# Altium schematic sheet Power.SchDoc
size A3; SheetNumber: 3; SheetTotal: 6
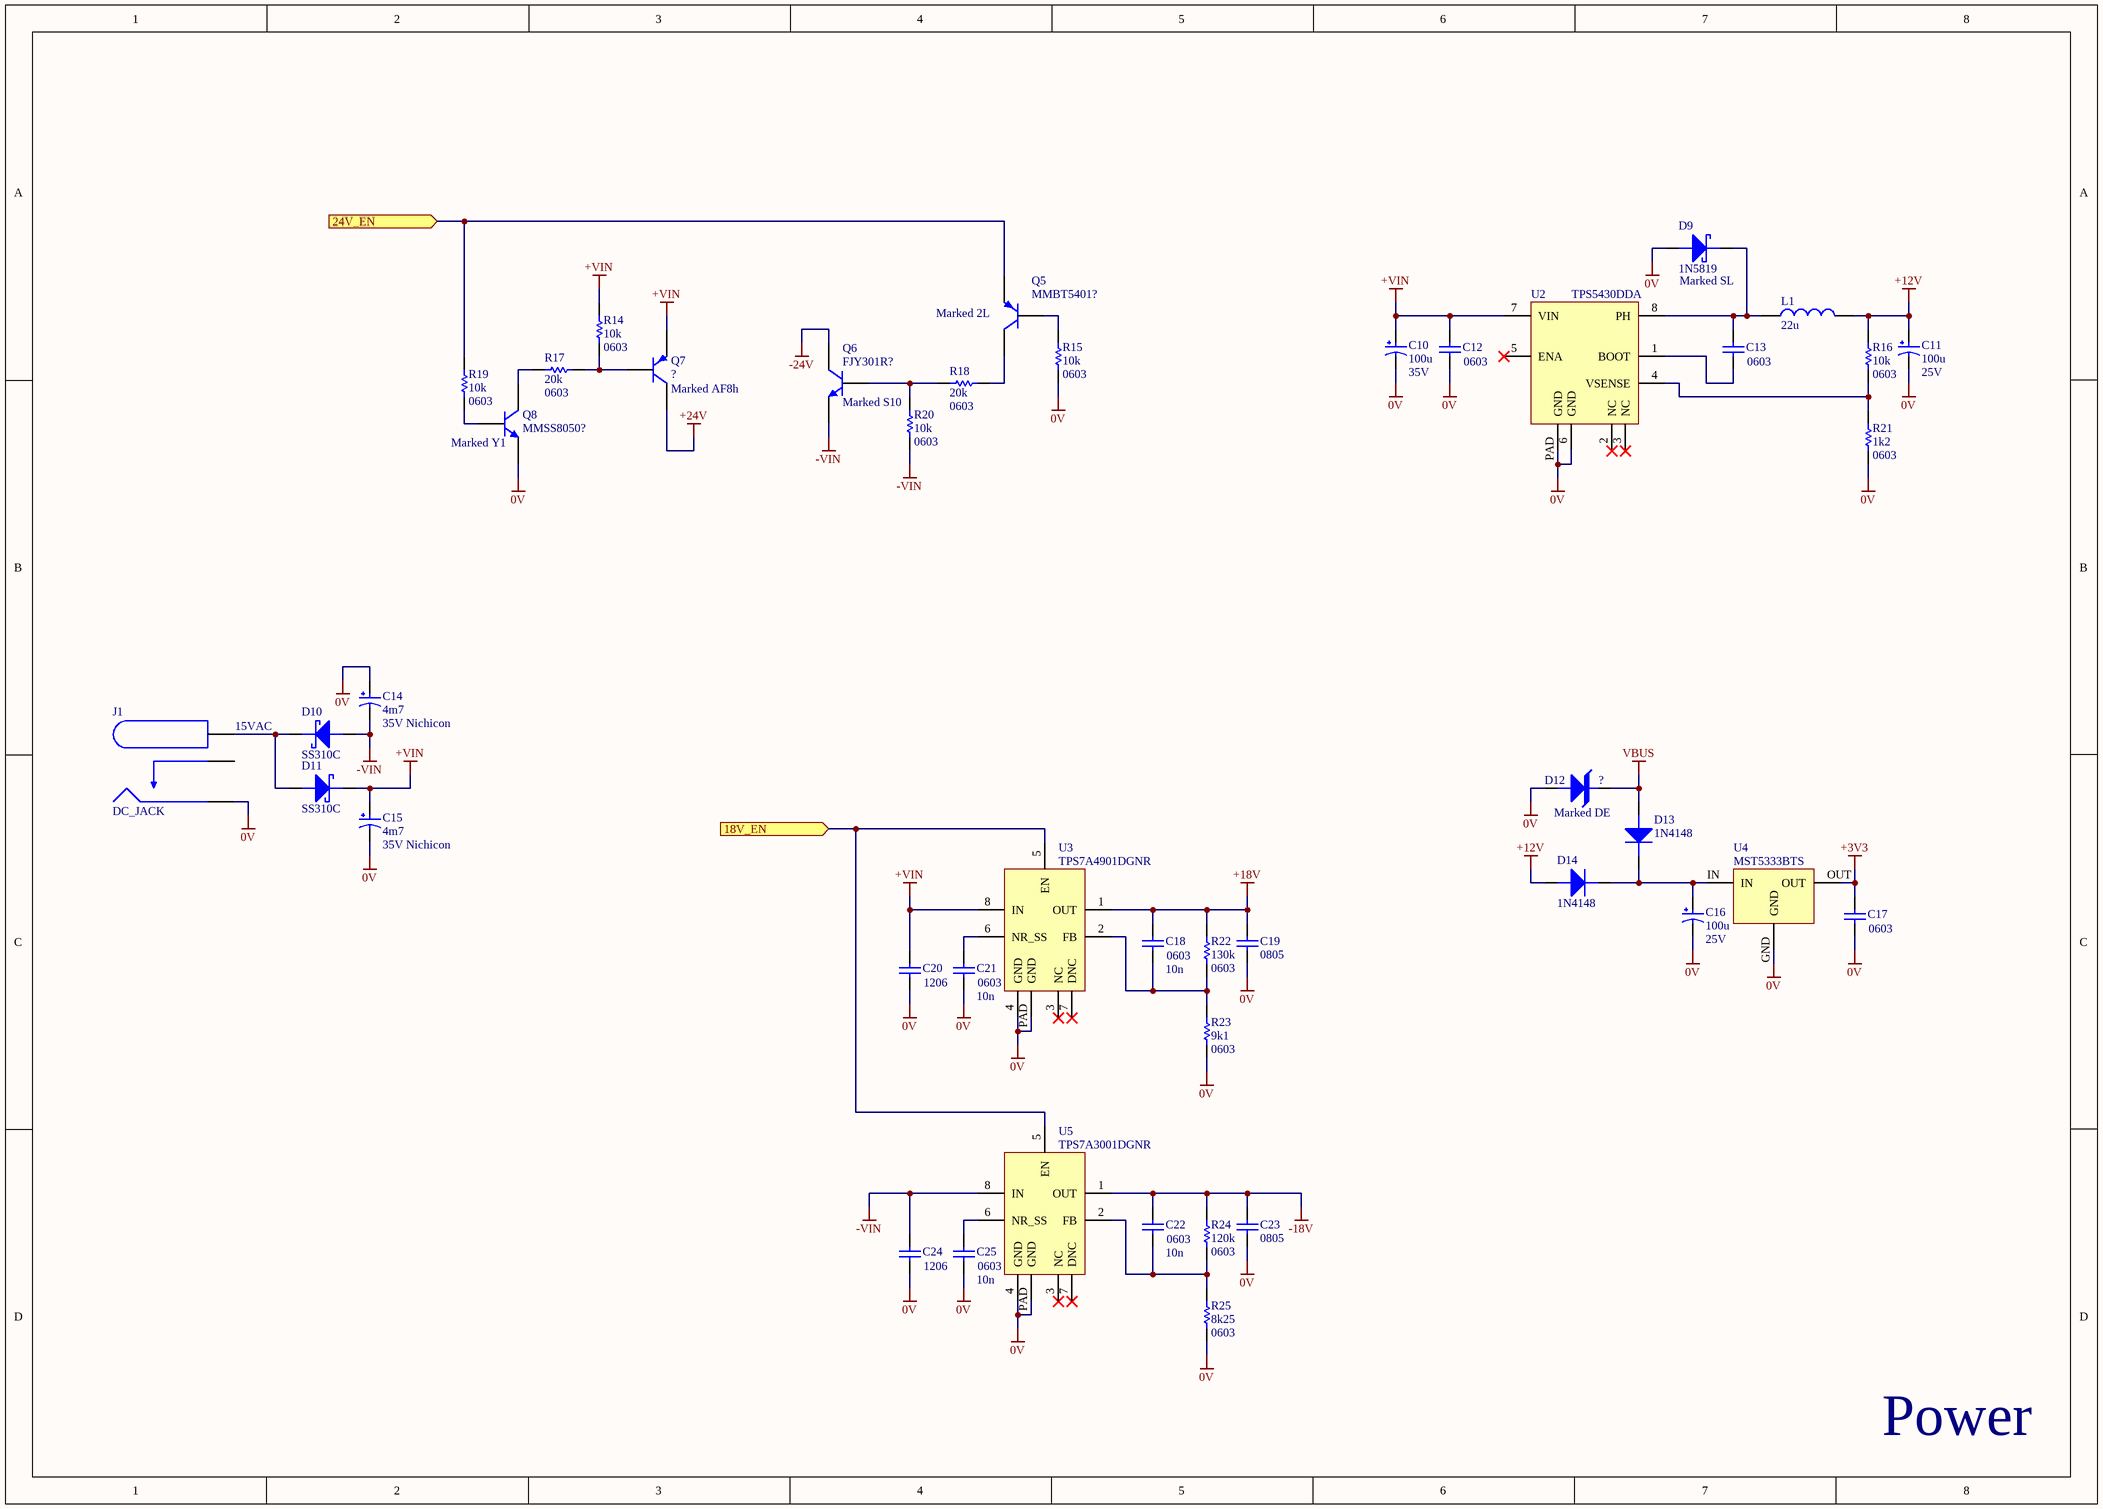
[diagram p0: Power.SchDoc]

## Parts
C10  value 100u  Notes: 35V  [CAPAE13X20]  (hidden comment: 860160378038)
C11  value 100u  Notes: 25V  [CAPAE13X20]  (hidden comment: 860160378038)
C12  Package: 0603  [CAPC1608X09N]  (hidden comment: C_MLCC_0603)
C13  Package: 0603  [CAPC1608X09N]  (hidden comment: C_MLCC_0603)
C14  value 4m7  Notes: 35V Nichicon  [CAPAE13X20]  (hidden comment: 860160378038)
C15  value 4m7  Notes: 35V Nichicon  [CAPAE13X20]  (hidden comment: 860160378038)
C16  value 100u  Notes: 25V  [CAPAE13X20]  (hidden comment: 860160378038)
C17  Package: 0603  [CAPC1608X09N]  (hidden comment: C_MLCC_0603)
C18  value 10n  Package: 0603  [CAPC1608X09N]  (hidden comment: C_MLCC_0603)
C19  Package: 0805  [CAPC2012X14N]  (hidden comment: C_MLCC_0805)
C20  Package: 1206  [C_NP_1206]  (hidden comment: C_MLCC_1206)
C21  value 10n  Package: 0603  [CAPC1608X09N]  (hidden comment: C_MLCC_0603)
C22  value 10n  Package: 0603  [CAPC1608X09N]  (hidden comment: C_MLCC_0603)
C23  Package: 0805  [CAPC2012X14N]  (hidden comment: C_MLCC_0805)
C24  Package: 1206  [C_NP_1206]  (hidden comment: C_MLCC_1206)
C25  value 10n  Package: 0603  [CAPC1608X09N]  (hidden comment: C_MLCC_0603)
D9  1N5819
D10  SS310C  [DIOM6959X26N]
D11  SS310C  [DIOM6959X26N]
D12  TVS  [DIOM4336X24N]  (value not drawn)
D13  1N4148
D14  1N4148
J1  DC_JACK  [DC_JACK]
L1  value 22u  (hidden comment: L)
Q5  value MMBT5401?  [SOT95P230X110-3N]  (hidden comment: MMBT5401)
Q6  value FJY301R?  [SOT95P230X110-3N]  (hidden comment: MMBT5551)
Q7  MMBT5401  [SOT95P230X110-3N]  (value not drawn)
Q8  value MMSS8050?  [SOT95P230X110-3N]  (hidden comment: MMBT5551)
R14  value 10k  Package: 0603  [RESC1608X06N]  (hidden comment: R)
R15  value 10k  Package: 0603  [RESC1608X06N]  (hidden comment: R)
R16  value 10k  Package: 0603  [RESC1608X06N]  (hidden comment: R)
R17  value 20k  Package: 0603  [RESC1608X06N]  (hidden comment: R)
R18  value 20k  Package: 0603  [RESC1608X06N]  (hidden comment: R)
R19  value 10k  Package: 0603  [RESC1608X06N]  (hidden comment: R)
R20  value 10k  Package: 0603  [RESC1608X06N]  (hidden comment: R)
R21  value 1k2  Package: 0603  [RESC1608X06N]  (hidden comment: R)
R22  value 130k  Package: 0603  [RESC1608X06N]  (hidden comment: R)
R23  value 9k1  Package: 0603  [RESC1608X06N]  (hidden comment: R)
R24  value 120k  Package: 0603  [RESC1608X06N]  (hidden comment: R)
R25  value 8k25  Package: 0603  [RESC1608X06N]  (hidden comment: R)
U2  TPS5430DDA  [SOIC127P600X170_HS-9N]
U3  TPS7A4901DGNR  [TSOP65P490X110_HS-9N]
U4  MST5333BTS  [SOT89-150P410X160-3N]
U5  TPS7A3001DGNR  [TSOP65P490X110_HS-9N]

## Ports
18V_EN (in, see Top[3B], STM[3B]), 24V_EN (in, see Top[3B], STM[5B])

## Nets
0V: C10.- C11.- C12.1 C14.+ C15.- C16.- C17.1 C19.1 C20.1 C21.1 C23.1 C24.1 C25.1 D9.A D12.A J1.S Q8.E R15.1 R21.1 R23.1 R25.1 U2.6(GND) U2.PAD(GND) U3.4(GND) U3.PAD(GND) U4.GND U5.4(GND) U5.PAD(GND)
+3V3: C17.2 U4.OUT
+12V: C11.+ D14.A L1.2 R16.2
+18V: C18.2 C19.2 R22.2 U3.1(OUT)
+24V: Q7.C
+VIN: C10.+ C12.2 C15.+ C20.2 D11.K Q7.E R14.1 U2.7(VIN) U3.8(IN)
-18V: C22.2 C23.2 R24.2 U5.1(OUT)
-24V: Q6.C
-VIN: C14.- C24.2 D10.A Q6.E R20.2 U5.8(IN)
VBUS: D12.K D13.A
18V_EN: U3.5(EN) U5.5(EN) ; port 18V_EN
24V_EN: Q5.E R19.1 ; port 24V_EN
NetC13_1: C13.1 U2.1(BOOT)
NetC13_2: C13.2 D9.K L1.1 U2.8(PH)
NetC16_+: C16.+ D13.K D14.K U4.IN
NetC18_1: C18.1 R22.1 R23.2 U3.2(FB)
NetC21_2: C21.2 U3.6(NR_SS)
NetC22_1: C22.1 R24.1 R25.2 U5.2(FB)
NetC25_2: C25.2 U5.6(NR_SS)
NetD10_K: D10.K D11.A J1.T
NetQ5_B: Q5.B R15.2
NetQ5_C: Q5.C R18.1
NetQ6_B: Q6.B R18.2 R20.1
NetQ7_B: Q7.B R14.2 R17.1
NetQ8_B: Q8.B R19.2
NetQ8_C: Q8.C R17.2
NetR16_1: R16.1 R21.2 U2.4(VSENSE)

Not connected (* = marked no-connect by the designer): J1 SN; U2 2(NC)* 3(NC)* 5(ENA)*; U3 3(NC)* 7(DNC)*; U5 3(NC)* 7(DNC)*

## Notes on the sheet
- (near Q5) Marked 2L
- (near D9) Marked SL
- (near Q8) Marked Y1
- (near Q7) Marked AF8h
- (near Q6) Marked S10
- 15VAC
- Marked DE
- Power

## Library data of the parts
C10 C11 C14-C16 = 860160378038: Alum. Electrolytic Cap 2200µF 16V 13mm Radial WCAP-ATLL; Lifetime 7000h +105°C; Manufacturer: Würth Elektronik; Impedance: 90mR; Ripple Current: 2.082A; Polarity: Polar; Life (Hours): 7000Hour; Tolerance: 20%; Capacitance: 2.2mF; Height - Seated (Max): 0.846inch; RoHS Compliant: Yes; Max Operating Temperature: 105°C; Sub-Category: Electrolytic; Mount: Through Hole; Min Operating Temperature: -55°C; Packaging: Tape and Reel; Category: Capacitor; Package Quantity: 300; Voltage Rating: 16V; Lead Pitch: 0.197inch; Case/Package: Radial; Manufacturer Part Number: 860160378038; Component Type: Standard_Passive_C
C12 C13 C17 C18 C21 C22 C25 = C_MLCC_0603: Generic MLCC 0603 Non Polarized Capacitor; Category: Capacitor; Sub-Category: MLCC; Manufacturer: Generic; Notes: *
  C12 C13 C17: Value: *
C19 C23 = C_MLCC_0805: Generic MLCC 0805 Non Polarized Capacitor; Category: Capacitor; Sub-Category: MLCC; Manufacturer: Generic; Notes: *; Value: *
C20 C24 = C_MLCC_1206: Generic MLCC Non Polarized Capacitor 1206; Manufacturer: Generic; Category: Capacitor; Sub-Category: MLCC; Notes: *; Value: *
D9 = 1N5819: Generic Schottky, 1N5819; Manufacturer Part Number: SS3H10-E3/9AT; Diode Element Material: SILICON; Forward Voltage-Max (VF): 650mV; Time @ Peak Reflow Temperature-Max (s): 40s; Diode Type: RECTIFIER; Number of Phases: 1; Non-rep Pk Forward Current-Max: 100A; Rep Pk Reverse Voltage-Max: 100V; Application(s): EFFICIENCY; Qualification Status: Not Qualified; JEDEC-95 Code: DO-214AB; Max Output Current: 3A; Package Body Material: Plastic; Terminal Position: DUAL; JESD-609 Code: e3; JESD-30 Code: R-PDSO-C2; Technology: SCHOTTKY; Min Operating Temperature: -65°C; Terminal Finish: Tin; Package Shape: Rectangular; RoHS Compliant: Yes; Manufacturer: Generic; REACH SVHC: No SVHC; Moisture Sensitivity Level: 1; Number of Elements: 1; Category: Diode; Peak Reflow Temperature (Cel): 260°C; Terminal Form: C BEND; Max Operating Temperature: 175°C; Number of Pins: 2; Package Style: SMALL OUTLINEMeter; Sub-Category: Power; Surface Mount: Yes; Component Type: Standard_Diode; Value: 1N5819
D10 D11 = SS310C: Rectifier Diode, Schottky, 1 Phase, 1 Element, 3A, 100V V(RRM), Silicon, DO-214AB; Manufacturer: Generic; Manufacturer Part Number: SS3H10-E3/9AT; Forward Voltage-Max (VF): 650mV; Time @ Peak Reflow Temperature-Max (s): 40s; Number of Phases: 1; Non-rep Pk Forward Current-Max: 100A; Application(s): EFFICIENCY; Qualification Status: Not Qualified; Package Body Material: Plastic; Terminal Position: DUAL; Diode Element Material: SILICON; JESD-609 Code: e3; JESD-30 Code: R-PDSO-C2; Technology: SCHOTTKY; Diode Type: RECTIFIER; Min Operating Temperature: -65°C; Terminal Finish: Tin; Package Shape: Rectangular; RoHS Compliant: Yes; Rep Pk Reverse Voltage-Max: 100V; REACH SVHC: No SVHC; Moisture Sensitivity Level: 1; Number of Elements: 1; Category: Diode; Peak Reflow Temperature (Cel): 260°C; Terminal Form: C BEND; JEDEC-95 Code: DO-214AB; Max Operating Temperature: 175°C; Max Output Current: 3A; Number of Pins: 2; Package Style: SMALL OUTLINEMeter; Sub-Category: Power; Surface Mount: Yes; Component Type: Standard_Diode; Package: SMC; Value: SS310C
D12 = TVS: Generic TVS diode; Manufacturer: Bourns; Manufacturer Part Number: SMBJ30A; Breakdown Voltage-Nom: 35.8V; JEDEC-95 Code: DO-214AA; Diode Element Material: SILICON; Min Breakdown Voltage: 33.3V; Max Power Dissipation: 5W; Rep Pk Reverse Voltage-Max: 30V; Number of Elements: 1; Reference Standard: IEC-61000-4-2; Diode Type: TRANS VOLTAGE SUPPRESSOR; Max Breakdown Voltage: 36.8V; Non-rep Peak Rev Power Dis-Max: 600W; Package Body Material: Plastic; Polarity: Unidirectional; Qualification Status: Not Qualified; Min Operating Temperature: -55°C; REACH SVHC: No SVHC; Terminal Finish: Tin; Moisture Sensitivity Level: 1; Number of Pins: 2; JESD-30 Code: R-PDSO-C2; Technology: AVALANCHE; Terminal Position: DUAL; Max Operating Temperature: 150°C; Package Style: SMALL OUTLINEMeter; Package Shape: Rectangular; Terminal Form: C BEND; RoHS Compliant: Yes; Surface Mount: Yes; JESD-609 Code: e3; Sub-Category: TVS; Category: Diode; Component Type: Standard_Diode; Value: ?
D13 D14 = 1N4148: Generic small signal diode; Manufacturer Part Number: BAT48ZFILM; Number of Elements: 1; Rep Pk Reverse Voltage-Max: 40V; Package Body Material: Plastic; Diode Type: RECTIFIER; Forward Voltage-Max (VF): 250mV; Non-rep Pk Forward Current-Max: 2A; Diode Element Material: SILICON; Time @ Peak Reflow Temperature-Max (s): 30s; Max Output Current: 350mA; Qualification Status: Not Qualified; Peak Reflow Temperature (Cel): 260°C; Max Operating Temperature: 150°C; Terminal Position: DUAL; Technology: SCHOTTKY; JESD-30 Code: R-PDSO-G2; Category: Diode; Surface Mount: Yes; RoHS Compliant: Yes; Manufacturer: Generic; Number of Pins: 2; Sub-Category: Signal; Terminal Form: Gull Wing; REACH SVHC: Yes; JESD-609 Code: e3; Package Shape: Rectangular; Package Style: SMALL OUTLINEMeter; Terminal Finish: Tin; Component Type: Standard_Diode; Value: 1N4148
J1 = DC_JACK: Generic Switched Horizontal DC Jack; Manufacturer: Generic; Category: Connector; Sub-Category: Jack; Value: DC_JACK
L1 = L: Generic L; Manufacturer Part Number: MPXV1D1054L150; RoHS Compliant: Yes; Sub-Category: Power; Manufacturer: Generic; Category: Inductor; Component Type: Standard_Passive_L
Q5 Q7 = MMBT5401: PNP Epitaxial Silicon Transistor; pin to pad: B>1 C>3 E>2; Manufacturer: MCC; Manufacturer Part Number: MMBT3904VL; Package Body Material: Plastic; JEDEC-95 Code: TO-236AB; Transistor Application: SWITCHING; Max Collector Current: 200mA; DC Current Gain-Min (hFE): 30; Turn-on Time-Max (ton): 70ns; Turn-off Time-Max (toff): 250ns; Number of Elements: 1; Polarity/Channel Type: NPN; Transition Frequency-Nom (fT): 300MHz; Collector-emitter Voltage-Max: 40V; Package Shape: Rectangular; JESD-30 Code: R-PDSO-G3; Number of Pins: 3; REACH SVHC: Yes; Sub-Category: BJT; RoHS Compliant: Yes; Transistor Element Material: SILICON; Terminal Position: DUAL; Surface Mount: Yes; Terminal Form: Gull Wing; Package Style: SMALL OUTLINEMeter; Category: Transistor; Component Type: Standard_Transistor
  Q7: Value: ?
Q6 Q8 = MMBT5551: NPN General-Purpose / Amplifier; pin to pad: B>1 C>3 E>2; Manufacturer: On Semi; Manufacturer Part Number: MMBT3904VL; Package Body Material: Plastic; JEDEC-95 Code: TO-236AB; Transistor Application: SWITCHING; Max Collector Current: 200mA; DC Current Gain-Min (hFE): 30; Turn-on Time-Max (ton): 70ns; Turn-off Time-Max (toff): 250ns; Transistor Element Material: SILICON; Number of Elements: 1; Transition Frequency-Nom (fT): 300MHz; Collector-emitter Voltage-Max: 40V; Package Shape: Rectangular; JESD-30 Code: R-PDSO-G3; Number of Pins: 3; REACH SVHC: Yes; Sub-Category: BJT; RoHS Compliant: Yes; Terminal Position: DUAL; Surface Mount: Yes; Terminal Form: Gull Wing; Package Style: SMALL OUTLINEMeter; Polarity/Channel Type: NPN; Category: Transistor; Component Type: Standard_Transistor
R14-R25 = R_0603: Generic 0603 Single Resistor; Manufacturer: Generic; Category: Resistor; Sub-Category: SMD; Notes: *
U2 = TPS5430DDA: Wide Input Range, Step-Down Converter; Manufacturer: Texas Instruments; Category: IC; Sub-Category: Power; Value: TPS5430DDA
U3 = TPS7A4901DGNR: –35-V, –200-mA, Ultralow-Noise, Positive Linear Regulator; Manufacturer: Texas Instruments; Package: HVSSOP8; Category: IC; Sub-Category: Power; Value: TPS7A4901DGNR
U4 = MST5333BTS: Fixed Positive Standard Regulator, 3.3VBIPolar, PSSO3; pin to pad: GND>2 IN>3 OUT>1; Manufacturer: Milestone Semiconductor Inc.; Manufacturer Part Number: L78L33ACUTR; Output Voltage1-Nom: 3.3V; Load Regulation-Max: 0.06%; Qualification Status: Not Qualified; Package Body Material: Plastic; Output Voltage1-Max: 3.465V; Number of Functions: 1; Regulator Type: FIXED POSITIVE SINGLE OUTPUT STANDARD REGULATOR; Output Voltage1-Min: 3.135V; Output Current1-Max: 70mA; Line Regulation-Max: 0.15%; Time @ Peak Reflow Temperature-Max (s): 30s; Max Input Voltage: 20V; Input Voltage Absolute-Max: 30V; Voltage Tolerance-Max: 5%; Dropout Voltage1-Nom: 1.7V; Min Input Voltage: 5.3V; Package Equivalence Code: TO-243; Operating Temperature, TJ-Min: 0°C; REACH SVHC: No SVHC; Terminal Form: Flat; Terminal Position: SINGLE; Packaging: Tape and Reel; Height - Seated (Max): 1.6mm; Operating Temperature, TJ-Max: 125°C; RoHS Compliant: Yes; Technology: BIPOLAR; Adjustability: FIXED; Number of Outputs: 1; Width: 2.445mm; Terminal Finish: Tin; Length: 4.5mm; Moisture Sensitivity Level: 1; Terminal Pitch: 1.495mm; JESD-30 Code: R-PSSO-F3; Number of Pins: 3; Peak Reflow Temperature (Cel): 260°C; Package Style: SMALL OUTLINEMeter; JESD-609 Code: e3; Package Shape: Rectangular; Surface Mount: Yes; Component Type: Standard_IC_Power; Category: IC; Sub-Category: Power; Package: SOT89; Value: MST5333BTS
U5 = TPS7A3001DGNR: –35-V, –200-mA, Ultralow-Noise, Negative Linear Regulator; Manufacturer: Texas Instruments; Package: HVSSOP8; Category: IC; Sub-Category: Power; Value: TPS7A3001DGNR